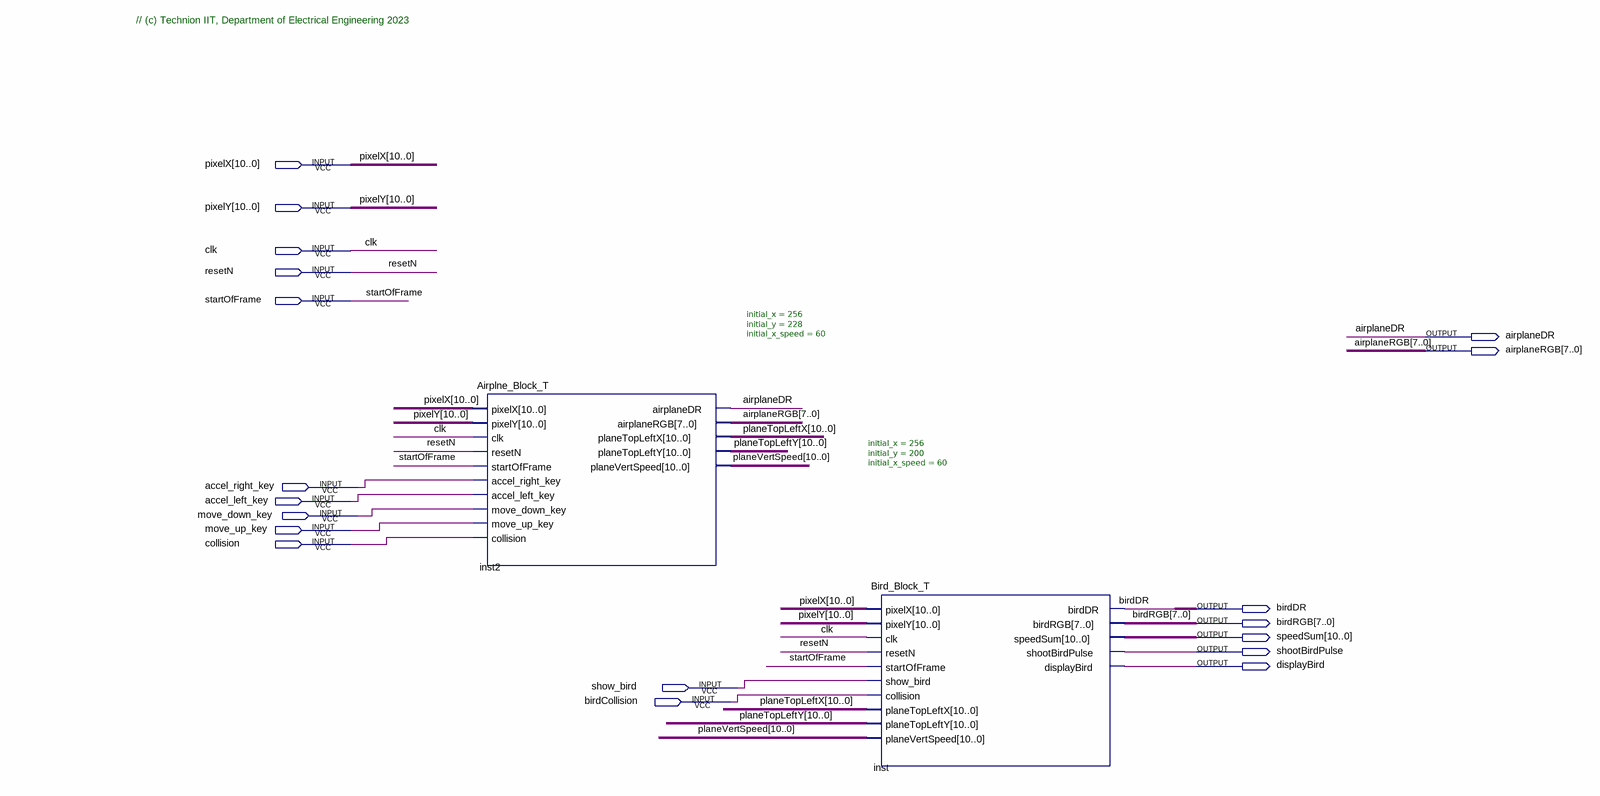
[diagram p0: schematic sheet]
// Quartus schematic AirplaneBird.bdf as structural Verilog: 2 symbols, 19 pins
module AirplaneBird (
  input  [10:0] pixelX,
  input  [10:0] pixelY,
  input  clk,
  input  resetN,
  input  startOfFrame,
  input  accel_right_key,
  input  accel_left_key,
  input  move_down_key,
  input  move_up_key,
  input  collision,
  input  show_bird,
  input  birdCollision,
  output airplaneDR,
  output [7:0] airplaneRGB,
  output birdDR,
  output [7:0] birdRGB,
  output [10:0] speedSum,
  output shootBirdPulse,
  output displayBird
);

  wire [10:0] planeTopLeftX, planeTopLeftY, planeVertSpeed;

  Airplne_Block_T #(.initial_x(256), .initial_y(228), .initial_x_speed(60)) inst2 (
    .pixelX(pixelX), .pixelY(pixelY), .clk(clk), .resetN(resetN), .startOfFrame(startOfFrame),
    .accel_right_key(accel_right_key), .accel_left_key(accel_left_key), .move_down_key(move_down_key),
    .move_up_key(move_up_key), .collision(collision), .airplaneDR(airplaneDR), .airplaneRGB(airplaneRGB),
    .planeTopLeftX(planeTopLeftX), .planeTopLeftY(planeTopLeftY), .planeVertSpeed(planeVertSpeed));
  Bird_Block_T #(.initial_x(256), .initial_y(200), .initial_x_speed(60)) inst (
    .pixelX(pixelX), .pixelY(pixelY), .clk(clk), .resetN(resetN), .startOfFrame(startOfFrame),
    .show_bird(show_bird), .collision(birdCollision), .planeTopLeftX(planeTopLeftX),
    .planeTopLeftY(planeTopLeftY), .planeVertSpeed(planeVertSpeed), .birdDR(birdDR), .birdRGB(birdRGB),
    .speedSum(speedSum), .shootBirdPulse(shootBirdPulse), .displayBird(displayBird));

  // Notes on the sheet:
  //   // (c) Technion IIT, Department of Electrical Engineering 2023
endmodule
